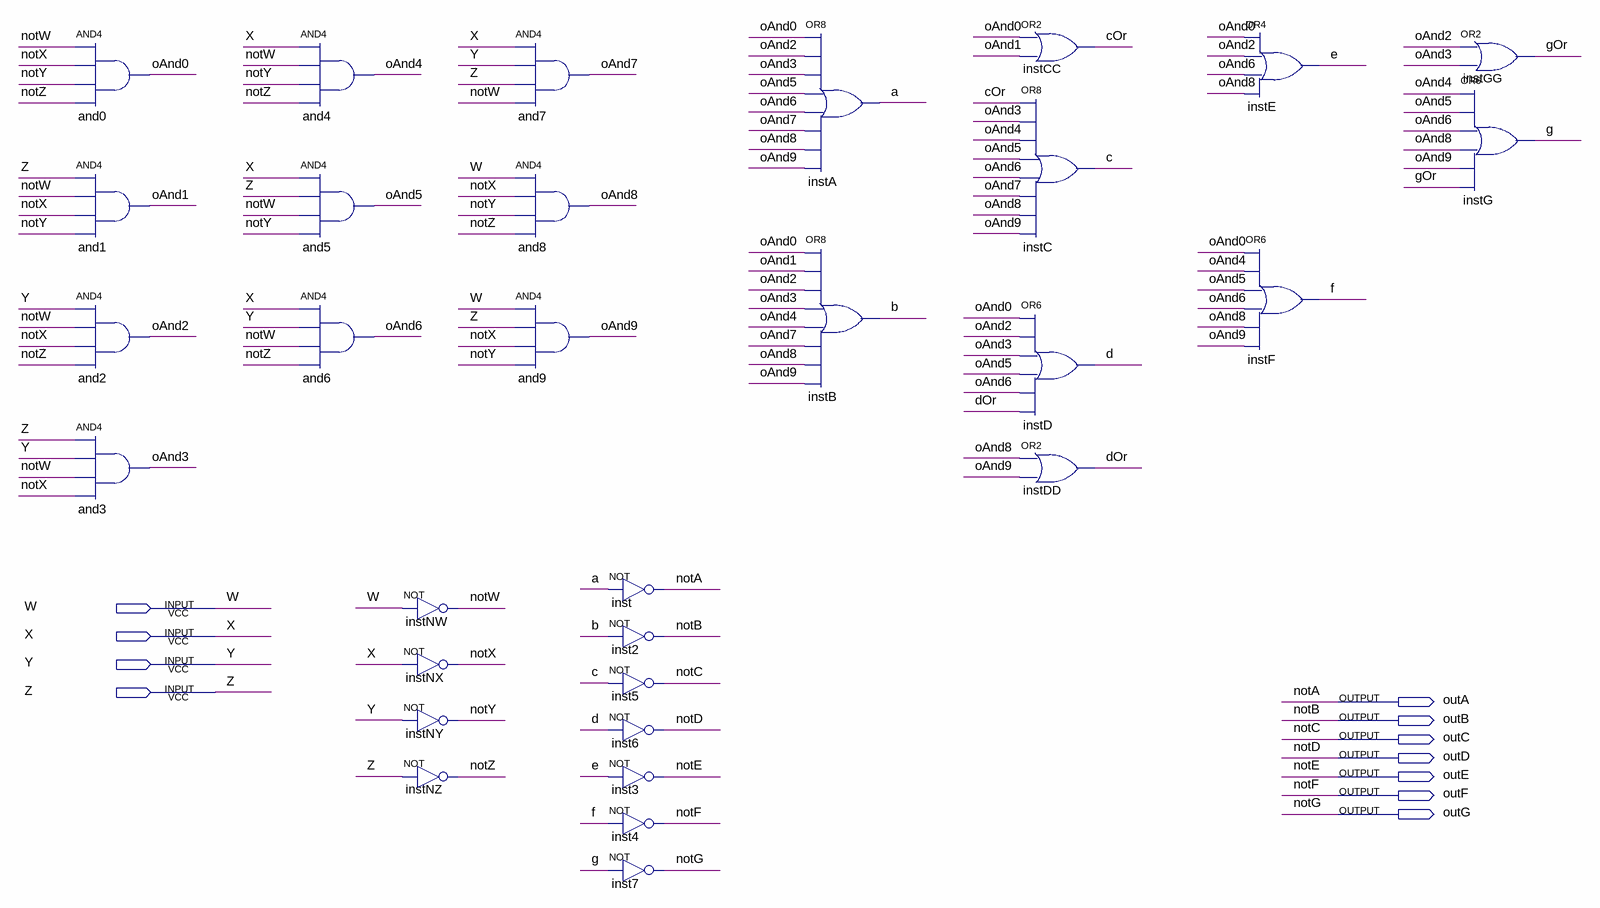
[diagram p0: schematic sheet]
// Quartus schematic Decodificador.bdf as structural Verilog: 31 symbols, 11 pins
module Decodificador (
  input  W,
  input  X,
  input  Y,
  input  Z,
  output outA,
  output outB,
  output outC,
  output outD,
  output outE,
  output outF,
  output outG
);

  wire a, b, c, cOr, d, dOr, e, f, g, gOr, notW, notX, notY, notZ, oAnd0, oAnd1, oAnd2, oAnd3, oAnd4, oAnd5,
       oAnd6, oAnd7, oAnd8, oAnd9;

  and and0 (oAnd0, notW, notX, notY, notZ);
  and and1 (oAnd1, Z, notW, notX, notY);
  and and2 (oAnd2, Y, notW, notX, notZ);
  and and3 (oAnd3, Z, Y, notW, notX);
  and and4 (oAnd4, X, notW, notY, notZ);
  and and5 (oAnd5, X, Z, notW, notY);
  and and6 (oAnd6, X, Y, notW, notZ);
  not instNW (notW, W);
  not instNX (notX, X);
  not instNY (notY, Y);
  not instNZ (notZ, Z);
  and and7 (oAnd7, X, Y, Z, notW);
  and and8 (oAnd8, W, notX, notY, notZ);
  and and9 (oAnd9, W, Z, notX, notY);
  not inst (outA, a);
  not inst2 (outB, b);
  not inst5 (outC, c);
  not inst6 (outD, d);
  not inst3 (outE, e);
  not inst4 (outF, f);
  not inst7 (outG, g);
  or instA (a, oAnd0, oAnd2, oAnd3, oAnd5, oAnd6, oAnd7, oAnd8, oAnd9);
  or instB (b, oAnd0, oAnd1, oAnd2, oAnd3, oAnd4, oAnd7, oAnd8, oAnd9);
  or instCC (cOr, oAnd0, oAnd1);
  or instC (c, cOr, oAnd3, oAnd4, oAnd5, oAnd6, oAnd7, oAnd8, oAnd9);
  or instD (d, oAnd0, oAnd2, oAnd3, oAnd5, oAnd6, dOr);
  or instDD (dOr, oAnd8, oAnd9);
  or instE (e, oAnd0, oAnd2, oAnd6, oAnd8);
  or instF (f, oAnd0, oAnd4, oAnd5, oAnd6, oAnd8, oAnd9);
  or instGG (gOr, oAnd2, oAnd3);
  or instG (g, oAnd4, oAnd5, oAnd6, oAnd8, oAnd9, gOr);

  // Other names for the same wires on the sheet: notA = outA; notB = outB; notC = outC; notD = outD; notE = outE;
  //   notF = outF; notG = outG
endmodule
